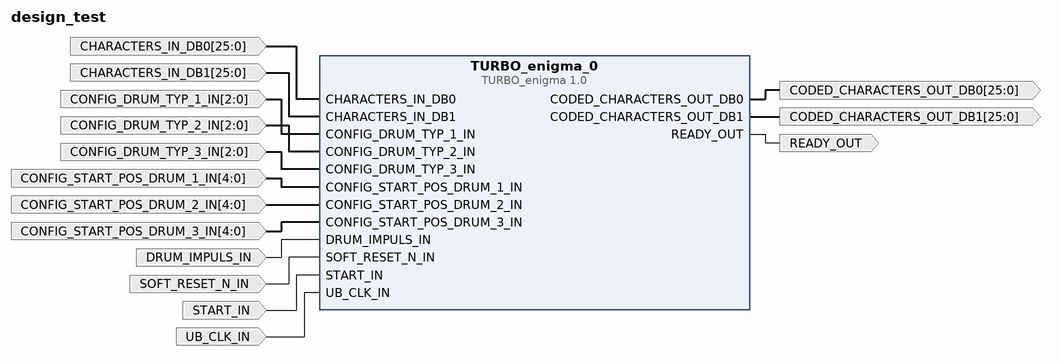
[diagram p0: block diagram of the top level]
# Vivado block design design_test, xc7z020clg400-1, Vivado 2018.3
create_bd_design design_test

create_bd_port -dir O -from 25 -to 0 CODED_CHARACTERS_OUT_DB0
create_bd_port -dir O -from 25 -to 0 CODED_CHARACTERS_OUT_DB1
create_bd_port -dir O READY_OUT
create_bd_port -dir I -from 25 -to 0 CHARACTERS_IN_DB0
create_bd_port -dir I -from 25 -to 0 CHARACTERS_IN_DB1
create_bd_port -dir I -from 2 -to 0 CONFIG_DRUM_TYP_1_IN
create_bd_port -dir I -from 2 -to 0 CONFIG_DRUM_TYP_2_IN
create_bd_port -dir I -from 2 -to 0 CONFIG_DRUM_TYP_3_IN
create_bd_port -dir I -from 4 -to 0 CONFIG_START_POS_DRUM_1_IN
create_bd_port -dir I -from 4 -to 0 CONFIG_START_POS_DRUM_2_IN
create_bd_port -dir I -from 4 -to 0 CONFIG_START_POS_DRUM_3_IN
create_bd_port -dir I DRUM_IMPULS_IN
create_bd_port -dir I -type rst SOFT_RESET_N_IN
create_bd_port -dir I START_IN
create_bd_port -dir I -type clk UB_CLK_IN
set_property -dict {CONFIG.FREQ_HZ 100000000} [get_bd_ports UB_CLK_IN]

create_bd_cell -type ip -vlnv user.org:user:TURBO_enigma:1.0 TURBO_enigma_0

# ---- connections ----

connect_bd_net -net CHARACTERS_IN_DB0_1 [get_bd_ports CHARACTERS_IN_DB0] [get_bd_pins TURBO_enigma_0/CHARACTERS_IN_DB0]
connect_bd_net -net CHARACTERS_IN_DB1_1 [get_bd_ports CHARACTERS_IN_DB1] [get_bd_pins TURBO_enigma_0/CHARACTERS_IN_DB1]
connect_bd_net [get_bd_ports CONFIG_DRUM_TYP_1_IN] [get_bd_pins TURBO_enigma_0/CONFIG_DRUM_TYP_1_IN]
connect_bd_net [get_bd_ports CONFIG_DRUM_TYP_2_IN] [get_bd_pins TURBO_enigma_0/CONFIG_DRUM_TYP_2_IN]
connect_bd_net [get_bd_ports CONFIG_DRUM_TYP_3_IN] [get_bd_pins TURBO_enigma_0/CONFIG_DRUM_TYP_3_IN]
connect_bd_net [get_bd_ports CONFIG_START_POS_DRUM_1_IN] [get_bd_pins TURBO_enigma_0/CONFIG_START_POS_DRUM_1_IN]
connect_bd_net [get_bd_ports CONFIG_START_POS_DRUM_2_IN] [get_bd_pins TURBO_enigma_0/CONFIG_START_POS_DRUM_2_IN]
connect_bd_net [get_bd_ports CONFIG_START_POS_DRUM_3_IN] [get_bd_pins TURBO_enigma_0/CONFIG_START_POS_DRUM_3_IN]
connect_bd_net [get_bd_ports DRUM_IMPULS_IN] [get_bd_pins TURBO_enigma_0/DRUM_IMPULS_IN]
connect_bd_net [get_bd_ports SOFT_RESET_N_IN] [get_bd_pins TURBO_enigma_0/SOFT_RESET_N_IN]
connect_bd_net [get_bd_ports START_IN] [get_bd_pins TURBO_enigma_0/START_IN]
connect_bd_net [get_bd_ports UB_CLK_IN] [get_bd_pins TURBO_enigma_0/UB_CLK_IN]
connect_bd_net [get_bd_pins TURBO_enigma_0/CODED_CHARACTERS_OUT_DB0] [get_bd_ports CODED_CHARACTERS_OUT_DB0]
connect_bd_net [get_bd_pins TURBO_enigma_0/READY_OUT] [get_bd_ports READY_OUT]
connect_bd_net [get_bd_pins TURBO_enigma_0/CODED_CHARACTERS_OUT_DB1] [get_bd_ports CODED_CHARACTERS_OUT_DB1]

validate_bd_design
save_bd_design
